# Altium schematic sheet XTIDA-010086_MAIN SHEET.SchDoc: MAIN-Sheet
size 558 x 431 mm; Date: Not shown in title block; ApprovedBy: Not shown in title block; CheckedBy: Not shown in title block; Author: Not shown in title block; CompanyName: Not shown in title block; DrawnBy: Jeff Xie; Engineer: Not shown in title block; Organization: Not shown in title block; Address1: Not shown in title block; Address2: Not shown in title block; Address3: Not shown in title block; Address4: Not shown in title block; DocumentNumber: 1; Revision: Use project parameter SCH_Rev; SheetNumber: 3; SheetTotal: 8; PageSetup: Record=PageOptions|CenterHorizontal=True|CenterVertical=True|PrintScale=1.00|XCorrection=1.00|YCorrection=1.00|PrintKind=0|BorderSize=5000000|LeftOffset=0|BottomOffset=0|Orientation=2|PaperLength=1000|PaperWidth=1000|Scale=100|PaperSource=15|PrintQuality=600|MediaType=1|DitherType=10|PaperKind=Letter|PrintScaleMode=1; CurrentTime: Not shown in title block; CurrentDate: Not shown in title block; Time: Not shown in title block; DocumentFullPathAndName: Not shown in title block; DocumentName: Not shown in title block; ModifiedDate: Not shown in title block; ImagePath: Not shown in title block
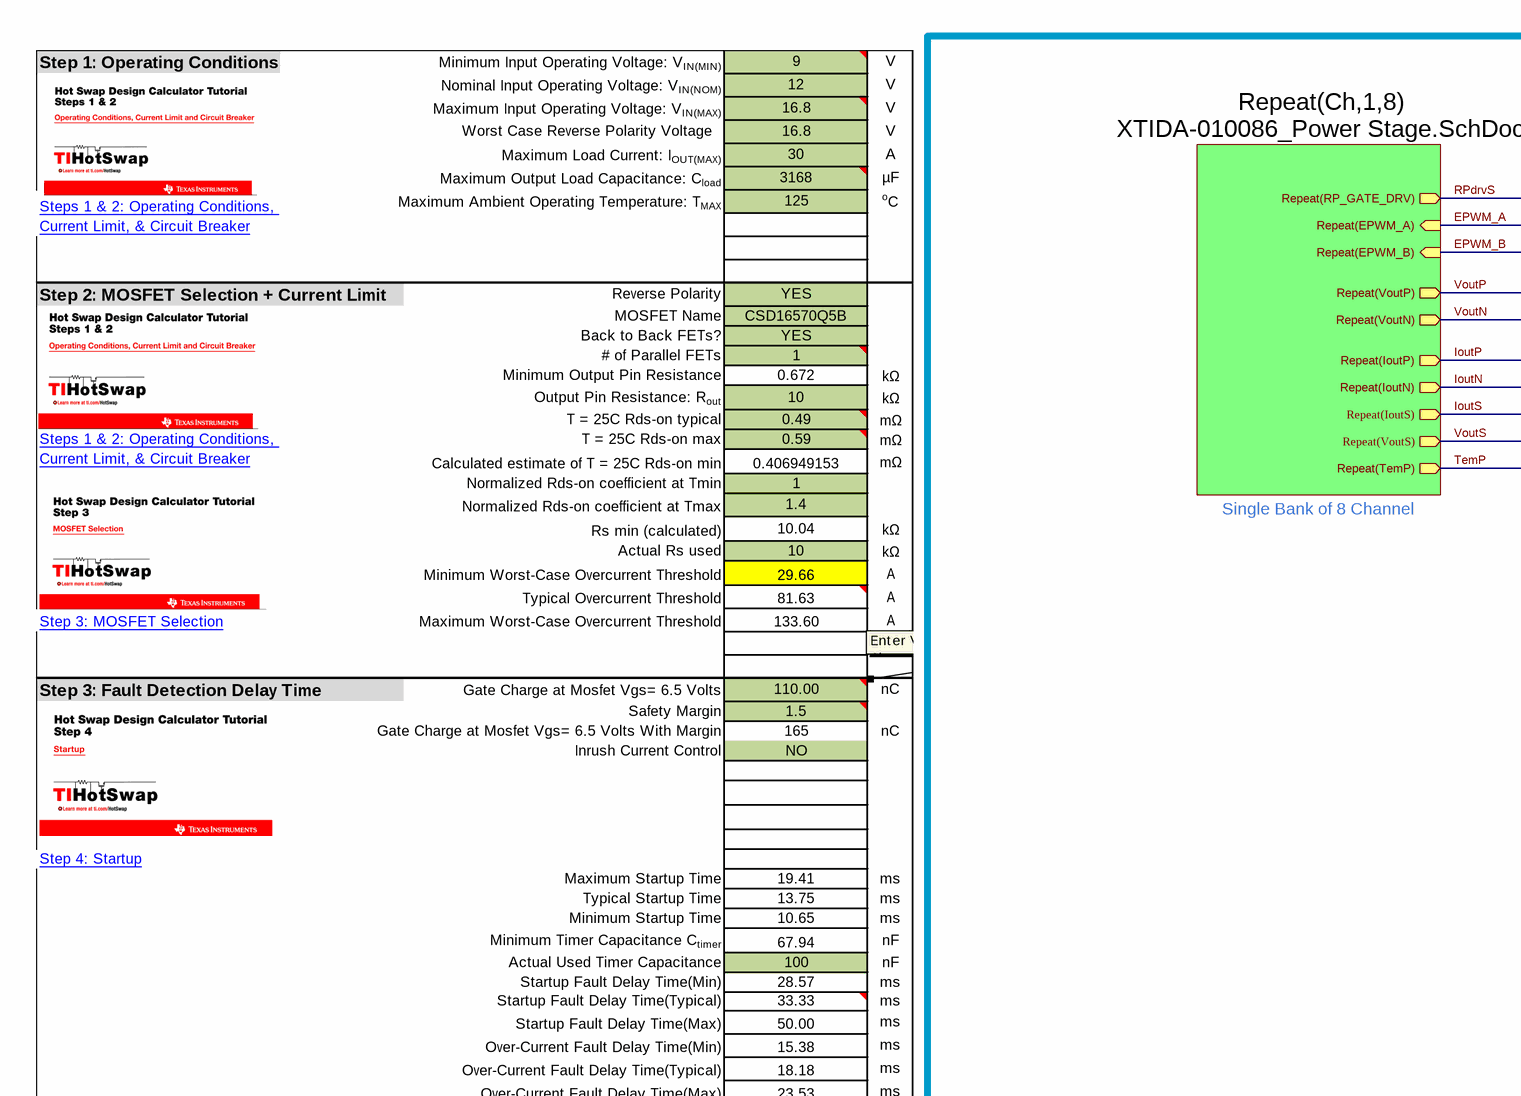
[diagram p0: XTIDA-010086_MAIN SHEET.SchDoc, top left]
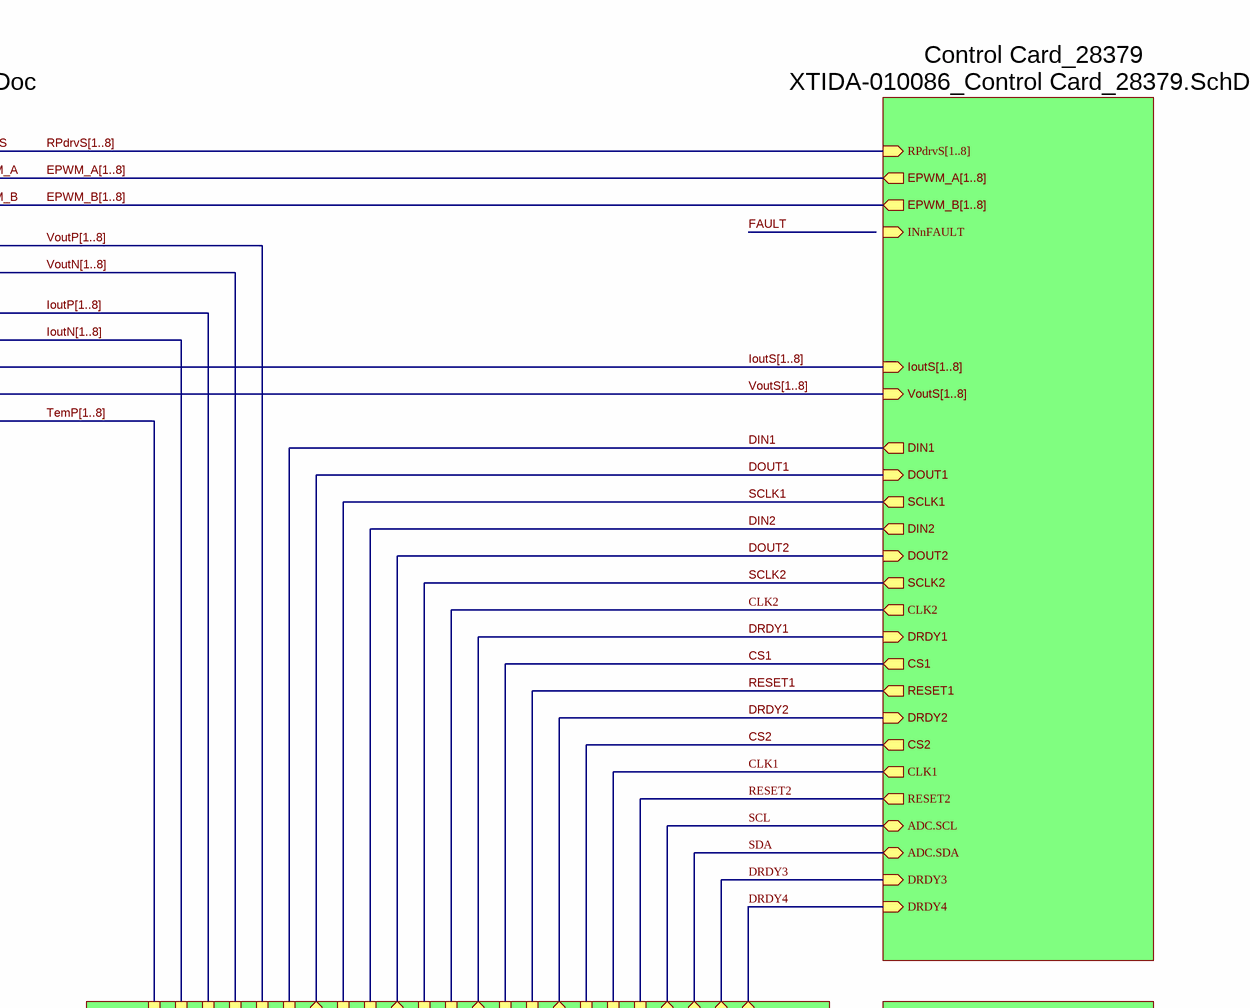
[diagram p1: XTIDA-010086_MAIN SHEET.SchDoc, top right]
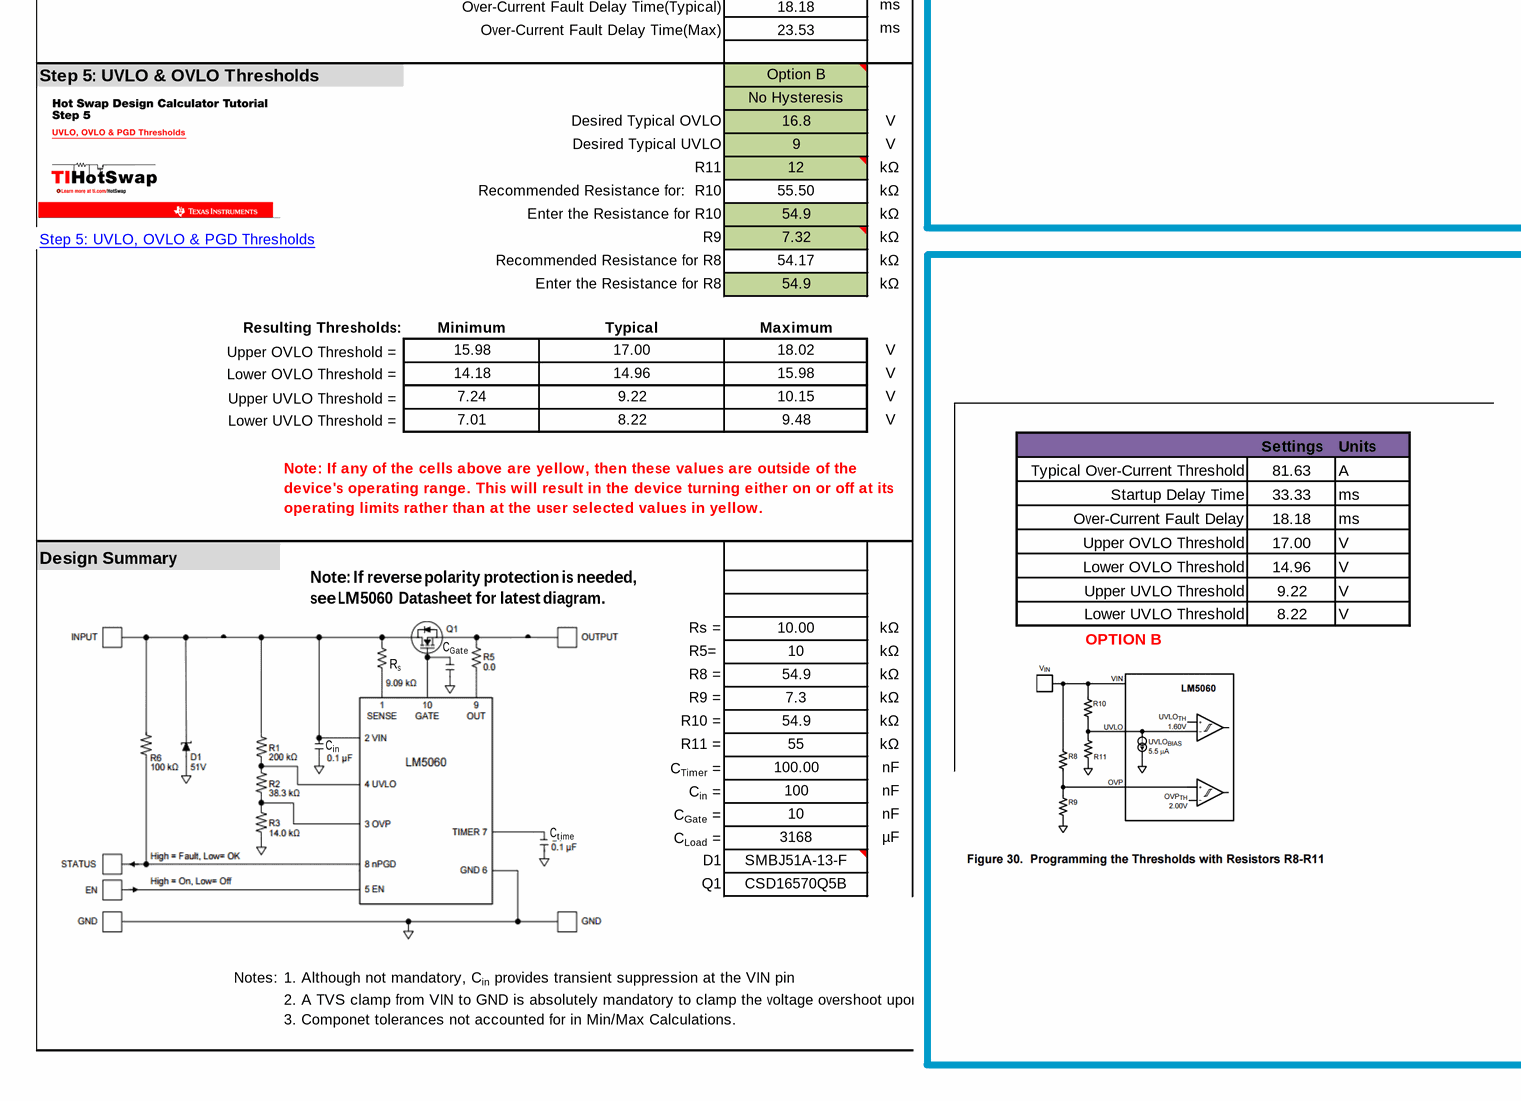
[diagram p2: XTIDA-010086_MAIN SHEET.SchDoc, bottom left]
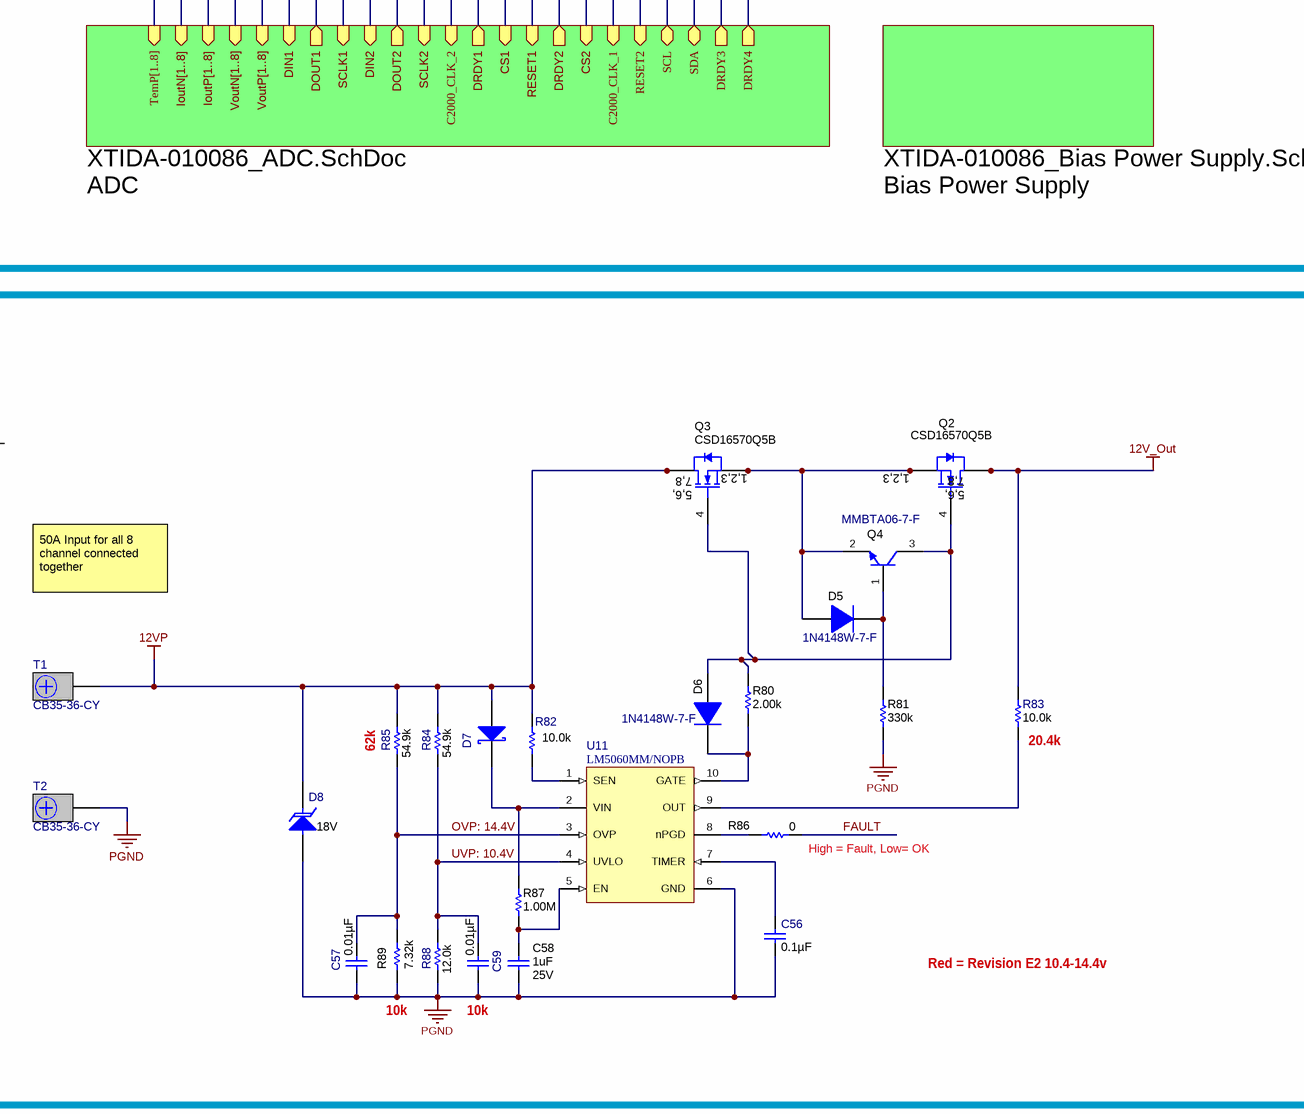
[diagram p3: XTIDA-010086_MAIN SHEET.SchDoc, bottom right]

## Parts
C56  ValueDisplayed: 0.1µF  [0603L]  (hidden comment: C0603C104J3RACTU)
C57  ValueDisplayed: 0.01µF  [0603L]  (hidden comment: GRM1885C1H103JA01D)
C58  ValueDisplayed: 1uF  VDC_V: 25V  [0603]  (hidden comment: GRM188R71E105KA12D)
C59  ValueDisplayed: 0.01µF  [0603L]  (hidden comment: GRM1885C1H103JA01D)
D5  1N4148W-7-F  [SOD-123]
D6  1N4148W-7-F  [SOD-123]
D7  NSR0240V2T1G  [SOD-523]  (value not drawn)
D8  value 18V  [SMA]  (hidden comment: SMAJ18A)
Q2  CSD16570Q5B  [DNK0008A]
Q3  CSD16570Q5B  [DNK0008A]
Q4  MMBTA06-7-F  [SOT-23]
R80  ValueDisplayed: 2.00k  [0603]  (hidden comment: CRCW06032K00FKEA)
R81  ValueDisplayed: 330k  [0603]  (hidden comment: RC0603FR-07330KL)
R82  ValueDisplayed: 10.0k  [0603L]  (hidden comment: RC0603FR-0710KL)
R83  ValueDisplayed: 10.0k  [0603L]  (hidden comment: RC0603FR-0710KL)
R84  ValueDisplayed: 54.9k  [0603L]  (hidden comment: RC0603FR-0754K9L)
R85  ValueDisplayed: 54.9k  [0603L]  (hidden comment: RC0603FR-0754K9L)
R86  ValueDisplayed: 0  [0402]  (hidden comment: CRCW04020000Z0ED)
R87  ValueDisplayed: 1.00M  [0603]  (hidden comment: CRCW06031M00FKEA)
R88  ValueDisplayed: 12.0k  [0603L]  (hidden comment: RC0603FR-0712KL)
R89  ValueDisplayed: 7.32k  [0603L]  (hidden comment: RC0603FR-077K32L)
T1  CB35-36-CY  [CB35-36-CY]
T2  CB35-36-CY  [CB35-36-CY]
U11  LM5060MM/NOPB  [MUB10A_N]

## Sub-sheets
ADC = XTIDA-010086_ADC.SchDoc: VoutP[1..8] (in), IoutN[1..8] (in), IoutP[1..8] (in), VoutN[1..8] (in), DIN1 (in), DOUT1 (out), SCLK1 (in), DRDY1 (out), CS1 (in), RESET1 (in), SCLK2 (in), DIN2 (in), DOUT2 (out), DRDY2 (out), CS2 (in), TemP[1..8] (in), DRDY4 (out), DRDY3 (out), SDA (bidir), RESET2 (in), SCL (bidir), C2000_CLK_2 (in), C2000_CLK_1 (in)
Bias Power Supply = XTIDA-010086_Bias Power Supply.SchDoc: no entries
Control Card_28379 = XTIDA-010086_Control Card_28379.SchDoc: SCLK1 (out), EPWM_A[1..8] (out), EPWM_B[1..8] (out), DIN2 (out), SCLK2 (out), DIN1 (out), DOUT1 (in), DOUT2 (in), DRDY1 (in), RESET1 (out), CS1 (out), DRDY2 (in), CS2 (out), ADC.SDA (bidir), ADC.SCL (bidir), DRDY3 (in), IoutS[1..8] (in), VoutS[1..8] (in), CLK1 (out), CLK2 (out), RESET2 (out), DRDY4 (in), RPdrvS[1..8] (in), INnFAULT (in)
Repeat(Ch,1,8) = XTIDA-010086_Power Stage.SchDoc: Repeat(VoutP) (out), Repeat(IoutP) (out), Repeat(EPWM_A) (in), Repeat(EPWM_B) (in), Repeat(VoutN) (out), Repeat(IoutN) (out), Repeat(TemP) (out), Repeat(VoutS) (out), Repeat(IoutS) (out), Repeat(RP_GATE_DRV) (out)

## Nets
12V_Out: Q2.5(D) Q2.6(D) Q2.7(D) Q2.8(D) Q2.9(D) R83.2
12VP: D7.2(A) D8.1(K) Q3.5(D) Q3.6(D) Q3.7(D) Q3.8(D) Q3.9(D) R82.1 R84.2 R85.2 T1.1
PGND: C56.1 C57.1 C58.2 C59.1 D8.2(A) R81.1 R88.1 R89.1 T2.1 U11.6(GND)
CLK1: sheet ADC/C2000_CLK_1, sheet Control Card_28379/CLK1
CLK2: sheet ADC/C2000_CLK_2, sheet Control Card_28379/CLK2
CS1: sheet ADC/CS1, sheet Control Card_28379/CS1
CS2: sheet ADC/CS2, sheet Control Card_28379/CS2
DIN1: sheet ADC/DIN1, sheet Control Card_28379/DIN1
DIN2: sheet ADC/DIN2, sheet Control Card_28379/DIN2
DOUT1: sheet ADC/DOUT1, sheet Control Card_28379/DOUT1
DOUT2: sheet ADC/DOUT2, sheet Control Card_28379/DOUT2
DRDY1: sheet ADC/DRDY1, sheet Control Card_28379/DRDY1
DRDY2: sheet ADC/DRDY2, sheet Control Card_28379/DRDY2
DRDY3: sheet ADC/DRDY3, sheet Control Card_28379/DRDY3
DRDY4: sheet ADC/DRDY4, sheet Control Card_28379/DRDY4
EPWM_A: sheet Repeat(Ch,1,8)/Repeat(EPWM_A)
EPWM_B: sheet Repeat(Ch,1,8)/Repeat(EPWM_B)
FAULT: R86.2
IoutN: sheet Repeat(Ch,1,8)/Repeat(IoutN)
IoutP: sheet Repeat(Ch,1,8)/Repeat(IoutP)
IoutS: sheet Repeat(Ch,1,8)/Repeat(IoutS)
OVP: 14.4V: C57.2 R85.1 R89.2 U11.3(OVP)
RESET1: sheet ADC/RESET1, sheet Control Card_28379/RESET1
RESET2: sheet ADC/RESET2, sheet Control Card_28379/RESET2
RPdrvS: sheet Repeat(Ch,1,8)/Repeat(RP_GATE_DRV)
SCL: sheet ADC/SCL, sheet Control Card_28379/ADC.SCL
SCLK1: sheet ADC/SCLK1, sheet Control Card_28379/SCLK1
SCLK2: sheet ADC/SCLK2, sheet Control Card_28379/SCLK2
SDA: sheet ADC/SDA, sheet Control Card_28379/ADC.SDA
TemP: sheet Repeat(Ch,1,8)/Repeat(TemP)
UVP: 10.4V: C59.2 R84.1 R88.2 U11.4(UVLO)
VoutN: sheet Repeat(Ch,1,8)/Repeat(VoutN)
VoutP: sheet Repeat(Ch,1,8)/Repeat(VoutP)
VoutS: sheet Repeat(Ch,1,8)/Repeat(VoutS)
NetC56_2: C56.2 U11.7(TIMER)
NetC58_1: C58.1 R87.1 U11.5(EN)
NetD5_1: D5.1(K) Q4.1(B) R81.2
NetD5_2: D5.2(A) Q2.1(S) Q2.2(S) Q2.3(S) Q3.1(S) Q3.2(S) Q3.3(S) Q4.2(E)
NetD6_1: D6.1(K) R80.1 U11.10(GATE)
NetD6_2: D6.2(A) Q2.4(G) Q3.4(G) Q4.3(C) R80.2
NetD7_1: D7.1(K) R87.2 U11.2(VIN)
NetR82_2: R82.2 U11.1(SEN)
NetR83_1: R83.1 U11.9(OUT)
NetR86_1: R86.1 U11.8(nPGD)

## Buses and harness runs
bus EPWM_A[1..8] = sheet Control Card_28379/EPWM_A[1..8]
bus EPWM_B[1..8] = sheet Control Card_28379/EPWM_B[1..8]
bus IoutN[1..8] = sheet ADC/IoutN[1..8]
bus IoutP[1..8] = sheet ADC/IoutP[1..8]
bus IoutS[1..8] = sheet Control Card_28379/IoutS[1..8]
bus RPdrvS[1..8] = sheet Control Card_28379/RPdrvS[1..8]
bus TemP[1..8] = sheet ADC/TemP[1..8]
bus VoutN[1..8] = sheet ADC/VoutN[1..8]
bus VoutP[1..8] = sheet ADC/VoutP[1..8]
bus VoutS[1..8] = sheet Control Card_28379/VoutS[1..8]

## Notes on the sheet
- Single Bank of 8 Channel
- 50A Input for all 8 channel connected together
- (near R85) 62k
- (near R83) 20.4k
- (near R86) High = Fault, Low= OK
- Red = Revision E2 10.4-14.4v
- 10k
- Drawn By:
- SVN Rev:
- Number:
- TID #:
- Orderable:
- Rev:
- Sheet Title:
- File:
- Project Title:
- Designed for:
- Assembly Variant:
- Mod. Date:
- Sheet:
- Size:
- of
- C
- http://www.ti.com
- Texas Instruments and/or its licensors do not warrant the accuracy or completeness of this specification or any information contained therein. Texas Instruments and/or its licensors do not warrant that this design will meet the specifications, will be suitable for your application or fit for any particular purpose, or will operate in an implementation. Texas Instruments and/or its licensors do not warrant that the design is production worthy. You should completely validate and test your design implementation to confirm the system functionality for your application.
- Engineer:
- Contact:
- © Texas Instruments
- (in symbol CSD16570Q5B) 7,8; 1,2,3; 5,6,

## Library data of the parts
C56 = C0603C104J3RACTU: CAP, CERM, 0.1 µF, 25 V, +/- 5%, X7R, 0603; Manufacturer: Kemet; Polarized: N; CompType: Capacitor; Value: 0.1uF; U/M: EA; Cap_F: 0.0000001; Tolerance_%: 5; Value1: Unknown; VDC_V: 25; Value2: 25V; TaMin_C: -55; TaMax_C: 125; Cap_Case: 0603; SizeArea_mm2: 1.28; SizeAreaWB_mm2: 4.68; SizeX_mm: 1.6; SizeY_mm: 0.8; SizeZ_mm: 1; AEC Category: Q200; AEC Qualified: Y; SymbolVersion: 2008-07-09; PartNumber: C0603C104J3RACTU; PackageReference: 0603; RoHS: Y; MountType: SMT; Technology: Ceramic; TempCo: X7R; Published: 2008-06-19; Publisher: Texas Instruments; LatestRevisionDate: 2016-09-23; ComponentLink1Description: Datasheet link; ComponentLink1URL: http://www.kemet.com/kemet/web/homepage/kechome.nsf/vapubfiles/F3102_Y5V.pdf/$file/F3102_Y5V.pdf; Supplier 1: Digi-Key; Supplier Part Number 1: 399-1282-1-ND; Supplier 2: Mouser; Supplier Part Number 2: 80-C0603C104J3R; Supplier 3: Farnell; Supplier Part Number 3: 1650833
C57 C59 = GRM1885C1H103JA01D: CAP, CERM, 0.01 µF, 50 V, +/- 5%, C0G/NP0, 0603; Manufacturer: MuRata; Polarized: N; CompType: Capacitor; Value: 0.01uF; U/M: EA; Cap_F: 0.00000001; Tolerance_%: 5; Value1: Unknown; VDC_V: 50; Value2: 50V; TaMin_C: -55; TaMax_C: 125; Cap_Case: 0603; SizeArea_mm2: 1.28; SizeAreaWB_mm2: 4.68; SizeX_mm: 1.6; SizeY_mm: 0.8; SizeZ_mm: 1; AEC Category: Q200; SymbolVersion: 2008-07-09; PartNumber: GRM1885C1H103JA01D; PackageReference: 0603; RoHS: Y; MountType: SMT; Technology: Ceramic; TempCo: C0G/NP0; Published: 2008-06-19; Publisher: Texas Instruments; LatestRevisionDate: 2017-03-17; ComponentLink1Description: Datasheet link; ComponentLink1URL: http://search.murata.co.jp/Ceramy/image/img/A01X/G101/ENG/GRM1885C1H103JA01-01.pdf; Supplier 1: Digi-Key; Supplier Part Number 1: 490-9666-1-ND; Supplier 2: Newark; Supplier Part Number 2: 31Y1764; Supplier 3: Mouser; Supplier Part Number 3: 81-GRM1885C1H103JA1D; AEC Qualified: N; AEC Grade: N/A
C58 = Capacitor: CAP, CERM, 1 uF, 25 V, +/- 10%, X7R, 0603; Manufacturer: MuRata; Polarized: N; Value: 1uF; U/M: EA; Cap_F: 1µF; Value1: Unknown; TaMin_C: -55°C; TaMax_C: 125°C; AEC Category: Q200; SizeArea_mm2: 1.28; SizeAreaWB_mm2: 4.68; SizeX_mm: 1.6; SizeY_mm: 0.8; SizeZ_mm: 1; CompType: Capacitor; PartNumber: GRM188R71E105KA12D; PackageReference: 0603; RoHS: Y; Tolerance_%: 10%; Value2: 25V; MountType: SMT; Technology: Ceramic; TempCo: X7R; Cap_Case: 0603; Published: 2008-06-19; Publisher: Texas Instruments; LatestRevisionDate: 2017-03-09; ComponentLink1Description: Datasheet link; ComponentLink1URL: http://search.murata.co.jp/Ceramy/PnsearchViewAction.do?HnOFG=ON&HnNFG=ON&SEL_CNT=50&sLang=en&sKey=GRM188R71E105KA12D&x=9&y=9&search=startwith; Supplier 1: Digi-Key; Supplier Part Number 1: 490-5307-1-ND; Supplier 2: Mouser; Supplier Part Number 2: 81-GRM188R71E105KA2D; Supplier 3: Farnell; Supplier Part Number 3: 1735540; AEC Qualified: ?
D5 D6 = DIODE: Diode, Ultrafast, 100 V, 0.15 A, SOD-123; Manufacturer: Diodes Inc.; Io_A: 150mA; Green_Lifecycle: Active; SizeAreaWB_mm2: 13.095; Vr_V: 100V; Green_REACh: Passed; Value1: 0.15A; TJmax_C: 150°C; U/M: EA; Value: 100V; SizeZ_mm: 1.35; SizeX_mm: 3.85; SizeY_mm: 1.7; Vf_V: 1.25V; SizeArea_mm2: 6.545; AEC Category: Q101; ComponentLink1URL: http://www.diodes.com/datasheets/ds30086.pdf; Supplier Part Number 2: 621-1N4148W-F; Publisher: Texas Instruments; Supplier 2: Mouser; Supplier Part Number 3: 1776392; Supplier 3: Farnell; Published: 2008-06-26; RoHS: Y; MountType: SMT; Green_EU RoHS-2: Passed; Supplier 1: Digi-Key; Green_EU RoHS: Passed; PackageReference: SOD-123; Value2: 1.25V; CompType: Diode; Type: Ultrafast; LatestRevisionDate: 2017-05-08; PartNumber: 1N4148W-7-F; AEC Qualified: ?; ComponentLink1Description: Datasheet link; Supplier Part Number 1: 1N4148W-FDICT-ND
D7 = NSR0240V2T1G: Diode, Schottky, 40V, 0.25A, SOD-523; Manufacturer: ON Semiconductor; U/M: EA; Vf_V: 0.7; Value2: 0.7V; Io_A: 0.25; Vr_V: 40; TJmax_C: 150; RJC_CperW: 600; CompType: Diode; SymbolVersion: 2008-12-08; PartNumber: NSR0240V2T1G; PackageReference: SOD-523; Value: 40V; Value1: 0.25A; MountType: SMT; Type: Schottky; RoHS: Y; Published: 2008-06-26; Publisher: Texas Instruments; LatestRevisionDate: 2014-07-21; ComponentLink1Description: Datasheet link; ComponentLink1URL: http://www.onsemi.com/pub_link/Collateral/NSR0240V2T1-D.PDF; Supplier 1: Digi-Key; Supplier Part Number 1: NSR0240V2T1GOSCT-ND; Supplier 2: Mouser; Supplier Part Number 2: 863-NSR0240V2T1G; Supplier 3: Newark; Supplier Part Number 3: 46P8323
D8 = SMAJ18A: Diode, TVS, Uni, 18 V, 29.2 Vc, SMA; Manufacturer: Littelfuse; U/M: EA; Value1: 3.3W; Vr_V: 18; Power_W: 3.3; RJA_CperW: 120; AEC Category: Q101; AEC Qualified: N; SizeAreaWB_mm2: 37.3428; SizeArea_mm2: 16.3228; SizeX_mm: 5.59; SizeY_mm: 2.92; SizeZ_mm: 2.87; CompType: TVS; SymbolVersion: 2012-01-13; PartNumber: SMAJ18A; PackageReference: SMA; MountType: SMT; RoHS: Y; Published: 2008-10-08; Publisher: Texas Instruments; LatestRevisionDate: 2016-12-21; ComponentLink1Description: Datasheet link; ComponentLink1URL: http://www.littelfuse.com/~/media/electronics/datasheets/tvs_diodes/littelfuse_tvs_diode_smaj_datasheet.pdf.pdf; Supplier 1: Digi-Key; Supplier Part Number 1: SMAJ18ALFCT-ND; Supplier 2: Mouser; Supplier Part Number 2: 576-SMAJ18A; Supplier 3: Farnell; Supplier Part Number 3: 1787557; Vz_V: N/A; LatestRevisionNote: Updated Supplier Data
Q2 Q3 = CSD16570Q5B: MOSFET, N-CH, 25 V, 100 A, DNK0008A (VSON-CLIP-8); Manufacturer: Texas Instruments; Alternate Manufacturer: None; U/M: EA; ChType: N; Value: 25V; VdsMax_V: 25; Value1: 0.0008 ohm; Rdson45_ohm: 0.0008; Value2: 192 nC; QgTyp_nC: 192; Vgs_V: 20; IdsMax_A: 100; SizeAreaWB_mm2: 56; SizeArea_mm2: 30; SizeX_mm: 6; SizeY_mm: 5; SizeZ_mm: 1; AEC Category: Q101; SymbolVersion: 2011-08-16; PartNumber: CSD16570Q5B; PackageReference: DNK0008A; CompType: MOSFET; RoHS: Y; MountType: SMT; Published: 2008-06-19; Publisher: Texas Instruments; LatestRevisionDate: 2017-03-20; LatestRevisionNote: Added parts.; ComponentLink1Description: Datasheet link; ComponentLink1URL: http://www.ti.com/lit/ds/symlink/csd16570q5b.pdf; Supplier 1: Digi-Key; Supplier Part Number 1: CSD16570Q5B-ND; Supplier 2: Newark; Supplier Part Number 2: 83X7113; Supplier 3: Mouser; Supplier Part Number 3: 595-CSD16570Q5B; AEC Qualified: N
Q4 = BJT_NPN_C3B1E2: Transistor, NPN, 80 V, 0.5 A, SOT-23; Manufacturer: Diodes Inc.; TaMax_C: 150°C; Value1: 0.5 A; Vcesat1_V: 250mV; SizeX_mm: 2.5; SizeY_mm: 3; TaMin_C: -55°C; IcRated_A: 500mA; CompType: BJT; SizeZ_mm: 1.1; Value: 80 V; SizeArea_mm2: 7.5; NPN: 1; Vceo_V: 80V; PNP: 0; AEC Category: Q101; SizeAreaWB_mm2: 14; U/M: EA; Supplier 2: Newark; Supplier 3: Mouser; Supplier 1: Digi-Key; Supplier Part Number 1: MMBTA06-FDICT-ND; Supplier Part Number 2: 51R6805; Supplier Part Number 3: 621-MMBTA06-F; PartNumber: MMBTA06-7-F; LatestRevisionDate: 2017-03-09; ComponentLink1URL: http://www.diodes.com/datasheets/ds30037.pdf; Publisher: Texas Instruments; AEC Qualified: ?; ComponentLink1Description: Datasheet link; Published: 2008-07-31; RoHS: Y; PackageReference: SOT-23; MountType: SMT
R80 = CRCW06032K00FKEA: RES, 2.00 k, 1%, 0.1 W, 0603; Manufacturer: Vishay-Dale; CompType: Resistor; Value: 2.00k; Res_ohm: 2000; Value_Code: 2k00; Tolerance_%: 1; Power_W: 0.1; Value2: 0.1W; VDC_V: 75; TempCo: 100 ppm/C; SizeArea_mm2: 1.28; SizeX_mm: 1.6; SizeY_mm: 0.8; EIA_Code: E96; U/M: EA; AEC Category: Q200; Green_Lifecycle: Active; Green_REACh: Passed; SymbolVersion: 2009-05-29; PartNumber: CRCW06032K00FKEA; PackageReference: 0603; RoHS: Y; Value1: 1%; MountType: SMT; Technology: Thick Film; SizeZ_mm: 1; Published: 2008-06-26; Publisher: Texas Instruments; LatestRevisionDate: 2017-06-13; ComponentLink1Description: Datasheet link; ComponentLink1URL: http://www.vishay.com/docs/20035/dcrcwe3.pdf; Supplier 1: Digi-Key; Supplier Part Number 1: 541-2.00KHCT-ND; Supplier 2: Newark; Supplier Part Number 2: 52K8223; Supplier 3: Mouser; Supplier Part Number 3: 71-CRCW0603-2.0K-E3; AEC Qualified: ?; Green_EU RoHS: Passed with Exemption; Green_EU RoHS-2: Passed
R81 = RC0603FR-07330KL: RES, 330 k, 1%, 0.1 W, 0603; Manufacturer: Yageo America; CompType: Resistor; Value: 330k; Res_ohm: 330000; Tolerance_%: 1; Power_W: 0.1; Value2: 0.1W; VDC_V: 150; TempCo: 200 ppm/C; SizeArea_mm2: 1.28; SizeX_mm: 1.6; SizeY_mm: 0.8; U/M: EA; AEC Category: Q200; Green_Lifecycle: Active; Green_REACh: Passed; SymbolVersion: 2009-05-29; PartNumber: RC0603FR-07330KL; PackageReference: 0603; RoHS: Y; Value_Code: 330k; Value1: 1%; MountType: SMT; Technology: Thick Film; SizeZ_mm: 1; Published: 2008-06-26; Publisher: Texas Instruments; LatestRevisionDate: 2017-06-13; ComponentLink1Description: Datasheet link; ComponentLink1URL: http://www.yageo.com/pdf/Pu-RC0603_51_PbFree_L_2.pdf; Supplier 1: Digi-Key; Supplier Part Number 1: 311-330KHRCT-ND; Supplier 2: Mouser; Supplier Part Number 2: 603-RC0603FR-07330KL; Supplier 3: Farnell; Supplier Part Number 3: 9238786; AEC Qualified: ?; Green_EU RoHS: Passed with Exemption; Green_EU RoHS-2: Passed
R82 R83 = RC0603FR-0710KL: RES, 10.0 k, 1%, 0.1 W, 0603; Manufacturer: Yageo America; CompType: Resistor; Value: 10.0k; Res_ohm: 10000; Value_Code: 10k0; Tolerance_%: 1; Power_W: 0.1; Value2: 0.1W; VDC_V: 150; TempCo: 200 ppm/C; SizeArea_mm2: 1.28; SizeX_mm: 1.6; SizeY_mm: 0.8; EIA_Code: E96; U/M: EA; AEC Category: Q200; SymbolVersion: 2009-05-29; PartNumber: RC0603FR-0710KL; PackageReference: 0603; RoHS: Y; Value1: 1%; MountType: SMT; Technology: Thick Film; SizeZ_mm: 1; Published: 2008-06-26; Publisher: Texas Instruments; LatestRevisionDate: 2016-09-18; ComponentLink1Description: Datasheet link; ComponentLink1URL: http://www.yageo.com/pdf/Pu-RC0603_51_PbFree_L_2.pdf; Supplier 1: Digi-Key; Supplier Part Number 1: 311-10.0KHRCT-ND; Supplier 2: Mouser; Supplier Part Number 2: 603-RC0603FR-0710KL; Supplier 3: Farnell; Supplier Part Number 3: 9238603; AEC Qualified: ?
R84 R85 = RC0603FR-0754K9L: RES, 54.9 k, 1%, 0.1 W, 0603; Manufacturer: Yageo America; CompType: Resistor; Value: 54.9k; Res_ohm: 54900; Value_Code: 54k9; Tolerance_%: 1; Power_W: 0.1; Value2: 0.1W; VDC_V: 150; TempCo: 200 ppm/C; SizeArea_mm2: 1.28; SizeX_mm: 1.6; SizeY_mm: 0.8; EIA_Code: E96; U/M: EA; AEC Category: Q200; SymbolVersion: 2009-05-29; PartNumber: RC0603FR-0754K9L; PackageReference: 0603; RoHS: Y; Value1: 1%; MountType: SMT; Technology: Thick Film; SizeZ_mm: 1; Published: 2008-06-26; Publisher: Texas Instruments; LatestRevisionDate: 2016-09-18; ComponentLink1Description: Datasheet link; ComponentLink1URL: http://www.yageo.com/pdf/Pu-RC0603_51_PbFree_L_2.pdf; Supplier 1: Digi-Key; Supplier Part Number 1: 311-54.9KHRCT-ND; Supplier 2: Mouser; Supplier Part Number 2: 603-RC0603FR-0754K9L; AEC Qualified: ?
R86 = CRCW04020000Z0ED: RES, 0, 5%, 0.063 W, 0402; Manufacturer: Vishay-Dale; CompType: Resistor; Value: 0; Value_Code: 0000; Tolerance_%: 5; Power_W: 0.063; Value2: 0.063W; VDC_V: 50; TempCo: 200 ppm/C; SizeArea_mm2: 0.5; SizeX_mm: 1; SizeZ_mm: 0.6; EIA_Code: E24; U/M: EA; AEC Category: Q200; Green_Lifecycle: Active; Green_REACh: Passed; SymbolVersion: 2009-05-29; PartNumber: CRCW04020000Z0ED; PackageReference: 0402; RoHS: Y; Res_ohm: 0; Value1: 5%; MountType: SMT; Technology: Thick Film; SizeY_mm: 0.5; Published: 2008-06-26; Publisher: Texas Instruments; LatestRevisionDate: 2017-06-12; ComponentLink1Description: Datasheet link; ComponentLink1URL: http://www.vishay.com/docs/20035/dcrcwe3.pdf; Supplier 1: Digi-Key; Supplier Part Number 1: 541-0.0JCT-ND; Supplier 2: Newark; Supplier Part Number 2: 52K6543; Supplier 3: Mouser; Supplier Part Number 3: 71-CRCW0402-0-E3; AEC Qualified: ?; Green_EU RoHS: Passed with Exemption; Green_EU RoHS-2: Passed
R87 = CRCW06031M00FKEA: RES, 1.00 M, 1%, 0.1 W, 0603; Manufacturer: Vishay-Dale; CompType: Resistor; Value: 1.00Meg; Res_ohm: 1000000; Value_Code: 1M00; Tolerance_%: 1; Power_W: 0.1; Value2: 0.1W; VDC_V: 75; TempCo: 100 ppm/C; SizeArea_mm2: 1.28; SizeX_mm: 1.6; SizeY_mm: 0.8; EIA_Code: E96; U/M: EA; AEC Category: Q200; Green_Lifecycle: Active; Green_REACh: Passed; SymbolVersion: 2009-05-29; PartNumber: CRCW06031M00FKEA; PackageReference: 0603; RoHS: Y; Value1: 1%; MountType: SMT; Technology: Thick Film; SizeZ_mm: 1; Published: 2008-06-26; Publisher: Texas Instruments; LatestRevisionDate: 2017-06-13; ComponentLink1Description: Datasheet link; ComponentLink1URL: http://www.vishay.com/docs/20035/dcrcwe3.pdf; Supplier 1: Digi-Key; Supplier Part Number 1: 541-1.00MHCT-ND; Supplier 2: Newark; Supplier Part Number 2: 52K8053; Supplier 3: Mouser; Supplier Part Number 3: 71-CRCW0603-1.0M-E3; AEC Qualified: ?; Green_EU RoHS: Passed with Exemption; Green_EU RoHS-2: Passed
R88 = RC0603FR-0710KL: RES, 12.0 k, 1%, 0.1 W, 0603; Manufacturer: Yageo America; CompType: Resistor; Value: 12.0k; Res_ohm: 10000; Value_Code: 12k0; Tolerance_%: 1; Power_W: 0.1; Value2: 0.1W; VDC_V: 150; TempCo: 200 ppm/C; SizeArea_mm2: 1.28; SizeX_mm: 1.6; SizeY_mm: 0.8; EIA_Code: E96; U/M: EA; AEC Category: Q200; SymbolVersion: 2009-05-29; PartNumber: RC0603FR-0712KL; PackageReference: 0603; RoHS: Y; Value1: 1%; MountType: SMT; Technology: Thick Film; SizeZ_mm: 1; Published: 2008-06-26; Publisher: Texas Instruments; LatestRevisionDate: 2016-09-18; ComponentLink1Description: Datasheet link; ComponentLink1URL: http://www.yageo.com/pdf/Pu-RC0603_51_PbFree_L_2.pdf; Supplier 1: Digi-Key; Supplier Part Number 1: 311-12.0KHRCT-ND; AEC Qualified: ?
R89 = CMP-0023278-3: RES, 7.32 k, 1%, 0.1 W, 0603; Manufacturer: Yageo America; Power_W: 100mW; TempCo: 200 ppm/C; Value_Code: 7k32; U/M: EA; Value: 7.32k; EIA_Code: E96; SizeX_mm: 1.6; SizeY_mm: 0.8; SizeZ_mm: 1; Value2: 0.1W; SizeArea_mm2: 1.28; CompType: Resistor; VDC_V: 150V; AEC Category: Q200; Supplier Part Number 2: 603-RC0603FR-077K32L; Publisher: Texas Instruments; Supplier 2: Mouser; Supplier Part Number 3: 1799353; Supplier 3: Farnell; Published: 2008-06-26; RoHS: Y; Value1: 1%; MountType: SMT; Supplier 1: Digi-Key; PackageReference: 0603; Tolerance_%: 1%; Res_ohm: 7.32k; LatestRevisionDate: 2017-03-09; PartNumber: RC0603FR-077K32L; AEC Qualified: ?; ComponentLink1Description: Datasheet link; Supplier Part Number 1: 311-7.32KHRCT-ND; Technology: Thick Film; ComponentLink1URL: http://www.yageo.com/pdf/Pu-RC0603_51_PbFree_L_2.pdf
T1 T2 = CB35-36-CY: Terminal 50A Lug; Manufacturer: Panduit; SymbolCreator: crossc; CompType: Screw Terminal; ContactFinish: Copper; Voltage_V: 600; Cert_CULUS: Y; Green_Lifecycle: Not Set; Green_REACh: Incomplete; SymbolVersion: 2009-10-14; PartNumber: CB35-36-CY; PackageReference: CB35-36-CY; RoHS: Y; MountType: TH; ComponentLink1Description: Datasheet URL; ComponentLink1URL: http://www.panduit.com/heiler/PartDrawings/C-PCCB25-18-CY--ENG.pdf; Publisher: Texas Instruments; LatestRevisionDate: 2017-06-26; Supplier 1: Digi-Key; Supplier Part Number 1: CB35-36-CY-ND; Green_EU RoHS: Incomplete; Green_EU RoHS-2: Incomplete
U11 = LM5060Q1MMX/NOPB: High-Side Protection Controller with Low Quiescent Current, 10-pin MSOP, Pb-Free; Manufacturer: Texas Instruments; CompType: Switcher; PackageTopMarking: ZXTT*SZAB; PowerWise: N; PartNumber: LM5060MM/NOPB; PackageReference: MUB10A; PackageDescription: Mini-SO, Molded, .118 x .118 x .034in Body, 10 Lead, .0197in Pitch; ComponentLink1Description: LM5060 Datasheet; ComponentLink1URL: http://www.national.com/ds/LM/LM5060.pdf; RoHS: Y; Publisher: Altium Limited; Published: 1-Mar-2010; DatasheetVersion: Nov-2009; PackageVersion: revB, Jul-2003; PinCount: 10; Code_JEDEC: MO-187-BA; ComponentLink2Description: LM5060 Web Page; ComponentLink2URL: http://www.national.com/pf/LM/LM5060.html; ComponentLink3Description: MUB10A Package Page; ComponentLink3URL: http://www.national.com/packaging/folders/mub10a.html